# EAGLE schematic T14_SuperDuperRev1 (EAGLE 6.3)
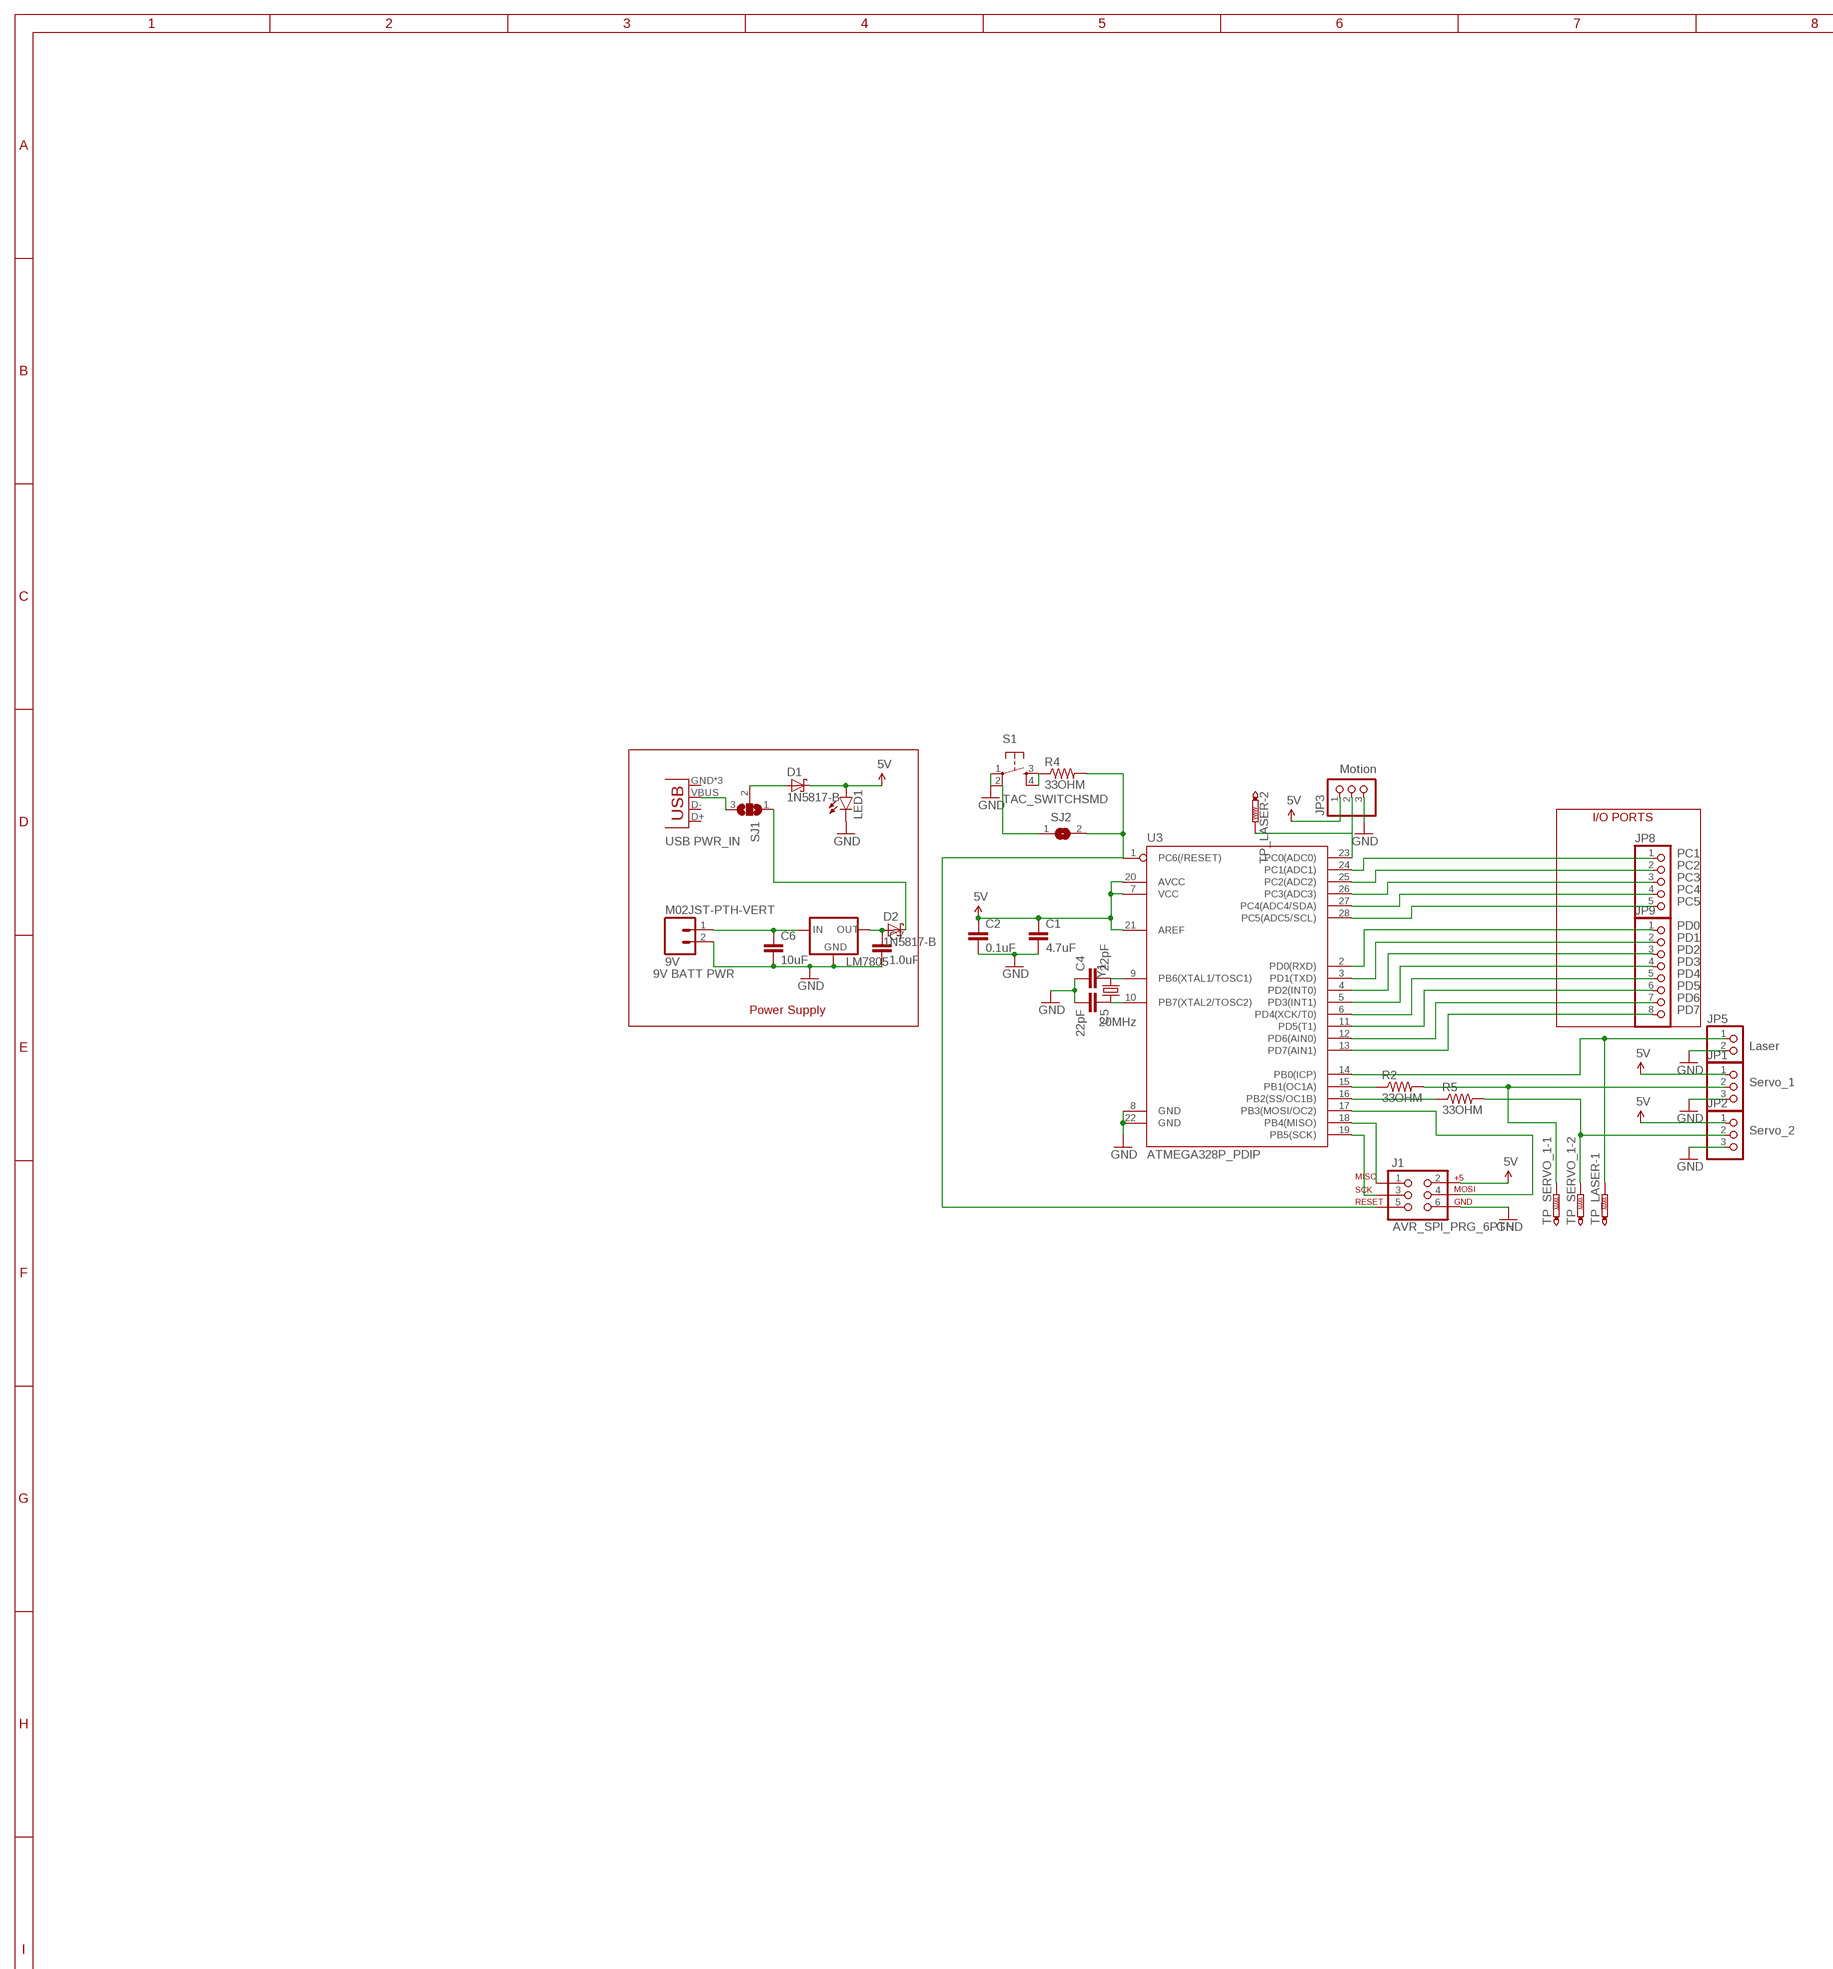
[diagram p0: schematic, sheet 1, part 1 of 2]
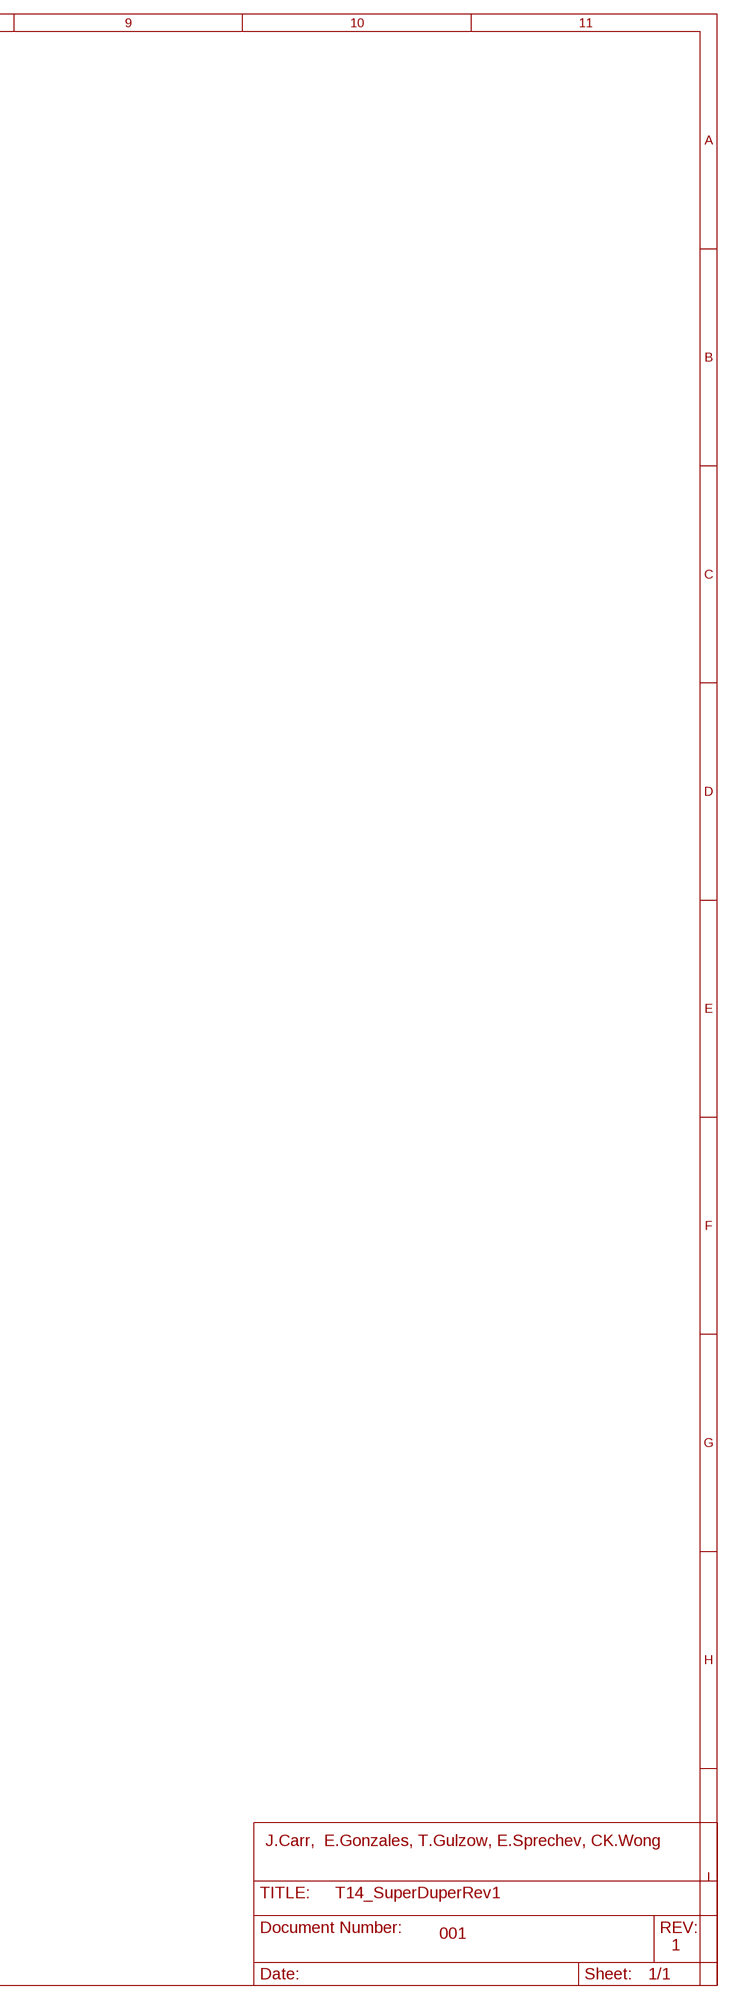
[diagram p1: schematic, sheet 1, part 2 of 2]

## Parts
9V  M02JST-PTH-VERT  [JST-2-PTH-VERT]
C1  4.7uF  4.7UF-6.3V-10%(0603)0603  [0603-CAP]
C2  0.1uF  0.1UF-25V(+80/-20%)(0603)  [0603-CAP]
C4  22pF  4.7UF-6.3V-10%(0603)0603  [0603-CAP]
C5  22pF  4.7UF-6.3V-10%(0603)0603  [0603-CAP]
C6  10uF  1.0UF-16V-10%(0402)  [0402-CAP]
C7  1.0uF  1.0UF-16V-10%(0402)  [0402-CAP]
D1  1N5817-B  [DO41-7.6]
D2  1N5817-B  [DO41-7.6]
J1  AVR_SPI_PRG_6PTH  [2X3]
JP1  PINHD-1X3  [1X03]
JP2  PINHD-1X3  [1X03]
JP3  PINHD-1X3  [1X03]
JP4  USB-MICROB  [USB-MICROB]
JP5  PINHD-1X2  [1X02]
JP8  PINHD-1X5  [1X05]
JP9  PINHD-1X8  [1X08]
LED1  LED-3MM-NO_SILK  [LED3MM-NS]
LM7805  V_REG_78XXSIDE  [78XXL]
R2  33OHM  33OHM1/10W1%(0603)  [0603]
R4  33OHM  33OHM1/10W1%(0603)  [0603]
R5  33OHM  33OHM1/10W1%(0603)  [0603]
S1  TAC_SWITCHSMD  [TACTILE-SWITCH-SMD]
SJ1  SJ2W  [SJ_2]
SJ2  SJ  [SJ]
TP_LASER  PTR2  [P2-38-17]
TP_SERVO_1  PTR2  [P2-38-17]
U3  ATMEGA328P_PDIP  [DIL28-3]
Y1  CRYSTAL10.5X4.8  [CRYSTAL-SMD-10.5X4.8-2PIN]

## Nets
5V: C1.1 C2.1 D1.C J1.2 JP1.1 JP2.1 JP3.1 LED1.A U3.7(VCC) U3.20(AVCC) U3.21(AREF)
GND: 9V.2 C1.2 C2.2 C4.1 C5.2 C6.2 C7.2 J1.6 JP1.3 JP2.3 JP3.3 JP5.2 LED1.K(C) LM7805.GND S1.1 S1.2 U3.8(GND) U3.22(GND)
N$1: R4.1 S1.3 S1.4
N$2: R2.1 U3.15(PB1(OC1A))
N$3: JP1.2 R2.2 TP_SERVO_1.TP-1
N$4: D2.C SJ1.1
N$5: C5.1 U3.10(PB7(XTAL2/TOSC2)) Y1.P$1
N$6: R5.1 U3.16(PB2(SS/OC1B))
N$7: JP2.2 R5.2 TP_SERVO_1.TP-2
N$8: 9V.1 C6.1 LM7805.IN
N$9: JP5.1 TP_LASER.TP-1 U3.14(PB0(ICP))
N$10: C7.1 D2.A LM7805.OUT
N$11: J1.4 U3.17(PB3(MOSI/OC2))
N$12: J1.1 U3.18(PB4(MISO))
N$13: J1.3 U3.19(PB5(SCK))
N$14: J1.5 R4.2 SJ2.2 U3.1(PC6(/RESET))
N$15: JP3.2 TP_LASER.TP-2 U3.23(PC0(ADC0))
N$16: C4.2 U3.9(PB6(XTAL1/TOSC1)) Y1.P$2
N$17: JP8.5 U3.28(PC5(ADC5/SCL))
N$18: JP8.4 U3.27(PC4(ADC4/SDA))
N$19: JP8.3 U3.26(PC3(ADC3))
N$20: JP8.2 U3.25(PC2(ADC2))
N$21: JP8.1 U3.24(PC1(ADC1))
N$22: JP9.1 U3.2(PD0(RXD))
N$23: JP9.2 U3.3(PD1(TXD))
N$24: JP9.3 U3.4(PD2(INT0))
N$25: JP9.4 U3.5(PD3(INT1))
N$26: JP9.5 U3.6(PD4(XCK/T0))
N$27: JP9.6 U3.11(PD5(T1))
N$28: JP9.7 U3.12(PD6(AIN0))
N$29: JP9.8 U3.13(PD7(AIN1))
N$30: SJ2.1
N$31: JP4.VBUS SJ1.3
N$32: D1.A SJ1.2
Unconnected: JP4.D+ JP4.D- JP4.GND JP4.MT1(GND) JP4.MT2(GND)

## Notes on the sheet
- Motion
- I/O PORTS
- USB PWR_IN
- PC1
- PC2
- PC3
- PC4
- PC5
- PD0
- PD1
- PD2
- PD3
- 9V BATT PWR | PD4
- PD5
- PD6
- Power Supply | PD7
- 20MHz
- Laser
- Servo_1
- Servo_2
- J.Carr,  E.Gonzales, T.Gulzow, E.Sprechev, CK.Wong
- 001
- 1

## Library data of the parts
9V = SparkFun-Connectors:M02: Standard 2-pin 0.1" header. Use with - straight break away headers ( PRT-00116) - right angle break away headers (PRT-00553) - swiss pins (PRT-00743) - machine pins (PRT-00117) - female headers (PRT-00115) Molex polarized connector foot print use with: PRT-08233 with associated crimp pins and housings. 2.54_SCREWTERM for use with PRT-10571. 3.5mm Screw Terminal footprints for PRT-08084 5mm Screw Terminal footprints for use with PRT-08432
C1 = SparkFun-Capacitors:4.7UF-6.3V-10%(0603): CAP-08280; PROD_ID: CAP-08280
C2 = SparkFun-Capacitors:0.1UF-25V(+80/-20%)(0603): CAP-00810 Ceramic Standard decoupling cap; PROD_ID: CAP-00810
C4 C5 = SparkFun-Capacitors:4.7UF-6.3V-10%(0603): CAP-08280; PROD_ID: CAP-08280; VALUE: 4.7uF
C6 = SparkFun-Capacitors:1.0UF-16V-10%(0402); PROD_ID: CAP-12417; VALUE: 1.0uF
C7 = SparkFun-Capacitors:1.0UF-16V-10%(0402); PROD_ID: CAP-12417
D1 D2 = diode:1N581*: 1.0A SCHOTTKY BARRIER RECTIFIER Source: http://www.diodes.com/datasheets/ds23001.pdf
J1 = SparkFun-Connectors:AVR_SPI_PRG_6: AVR ISP 6 Pin This is the reduced ISP connector for AVR programming. Common on Arduino. This footprint will take up less PCB space and can be used with a 10-pin to 6-pin adapter such as SKU: BOB-08508 **Special note about "TEST_POINT" package. The stop mask is on the top side, so if you want your programming test points to be on the bottom of your board, make sure to place this package on the bottom side of the board. This also ensure that the orientation to program from the bottom side will be correct.
JP1-JP3 = pinhead:PINHD-1X3: PIN HEADER
JP4 = SparkFun-Connectors:USB: USB Connectors USB-B-PTH is fully proven SKU : PRT-00139/CONN-08278 USB-miniB is fully proven SKU : PRT-00587 USB-A-PCB is untested. USB-A-H is throughly reviewed, but untested. Spark Fun Electronics SKU : PRT-00437 USB-B-SMT is throughly reviewed, but untested. Needs silkscreen touching up. USB-A-S has not been used/tested USB-MB-H has not been used/tested USB-MICROB has been used. CONN-09505; PROD_ID: CONN-09505
JP5 = pinhead:PINHD-1X2: PIN HEADER
JP8 = pinhead:PINHD-1X5: PIN HEADER
JP9 = pinhead:PINHD-1X8: PIN HEADER
LED1 = SparkFun-LED:LED: LEDs Standard schematic elements and footprints for 5mm, 3mm, 1206, and 0603 sized LEDs. 5mm - Spark Fun Electronics SKU : COM-00529 (and others)
LM7805 = SparkFun-PowerIC:V_REG_78XX: Voltage Regulator Standard 7805 5V regulator. IGO (Input Ground Output). Spark Fun Electronics SKU : COM-00107
R2 R4 R5 = SparkFun-Resistors:33OHM1/10W1%(0603): RES-08270; PROD_ID: RES-08270
S1 = SparkFun-Electromechanical:TAC_SWITCH: Momentary Switch Button commonly used for reset or general input. Spark Fun Electronics SKU : COM-00097 SMT- SWCH-08247; PROD_ID: SWCH-08247
SJ1 = jumper:SJ2W: SMD solder JUMPER
SJ2 = jumper:SJ: SMD solder JUMPER
TP_LASER TP_SERVO_1 = testpad:PTR2: TEST PIN
U3 = SparkFun-DigitalIC:ATMEGA328P_PDIP: uC used in the Arduino 32kb flash, 1k EEPROM, 2k SRAM This is the through-hole version of this chip.
Y1 = SparkFun-FreqCtrl:CRYSTAL: Various standard crystals. Proven footprints. Spark Fun Electronics SKU : COM-00534